# Altium schematic sheet Push-Pull Amplifier.schdoc: Push-Pull Amp
size A4; Organization: Altium Limited; Address1: L3, 12a Rodborough Rd; Address2: Frenchs Forest; Address3: NSW; Address4: Australia 2086; DocumentNumber: 1; SheetNumber: 1; SheetTotal: 1
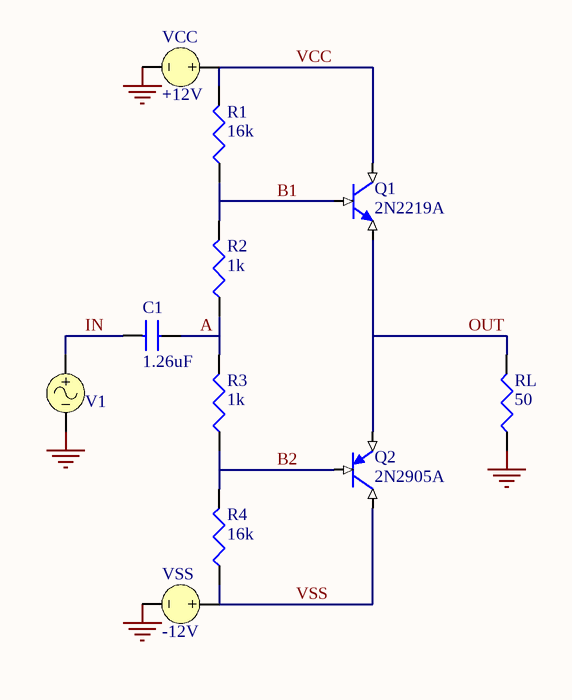
[diagram p0: Push-Pull Amplifier.schdoc]

## Parts
C1  1.26uF
Q1  2N2219A
Q2  2N2905A
R1  16k
R2  1k
R3  1k
R4  16k
RL  50
V1  VSIN  (value not drawn)
VCC  +12V
VSS  -12V

## Nets
GND: RL.2(BOT) V1.2 VCC.2 VSS.2
A: C1.2 R2.2(BOT) R3.1(TOP)
B1: Q1.2(B) R1.2(BOT) R2.1(TOP)
B2: Q2.2(B) R3.2(BOT) R4.1(TOP)
IN: C1.1 V1.1
OUT: Q1.3(E) Q2.3(E) RL.1(TOP)
VCC: Q1.1(C) R1.1(TOP) VCC.1
VSS: Q2.1(C) R4.2(BOT) VSS.1

## Notes on the sheet
- Title
- Size:
- Date:
- A4
- Number:
- Time:
- Revision:
- Sheet
- of
- File:

## Library data of the parts
C1 = CAP: Capacitor; Value: 1.26uF
Q1 = 2N2219A: NPN BJT
Q2 = 2N2905A: PNP BJT
R1-R4 RL = RES: Resistor
  R1 R4: Value: 16k
  R2 R3: Value: 1k
  RL: Value: 50
V1 = VSIN: Sinusoidal Voltage Source
VCC VSS = VSRC: Voltage Source
  VCC: Value: +12V
  VSS: Value: -12V